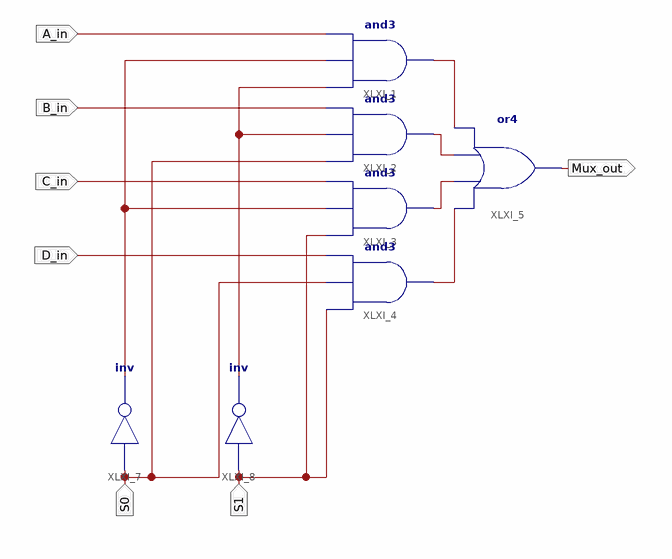
[diagram p0: schematic sheet 1]
// Xilinx ISE schematic Mux4to1.sch (spartan6) as structural Verilog: 7 symbols, 7 ports
module Mux4to1 (
  input  A_in,
  input  B_in,
  input  C_in,
  input  D_in,
  input  S0,
  input  S1,
  output Mux_out
);

  wire XLXN_1, XLXN_2, XLXN_3, XLXN_4, XLXN_9, XLXN_10;

  and XLXI_3 (XLXN_3, S1, XLXN_9, C_in);
  and XLXI_2 (XLXN_2, S0, XLXN_10, B_in);
  and XLXI_4 (XLXN_4, S1, S0, D_in);
  and XLXI_1 (XLXN_1, XLXN_10, XLXN_9, A_in);
  or XLXI_5 (Mux_out, XLXN_4, XLXN_3, XLXN_2, XLXN_1);
  not XLXI_7 (XLXN_9, S0);
  not XLXI_8 (XLXN_10, S1);
endmodule
